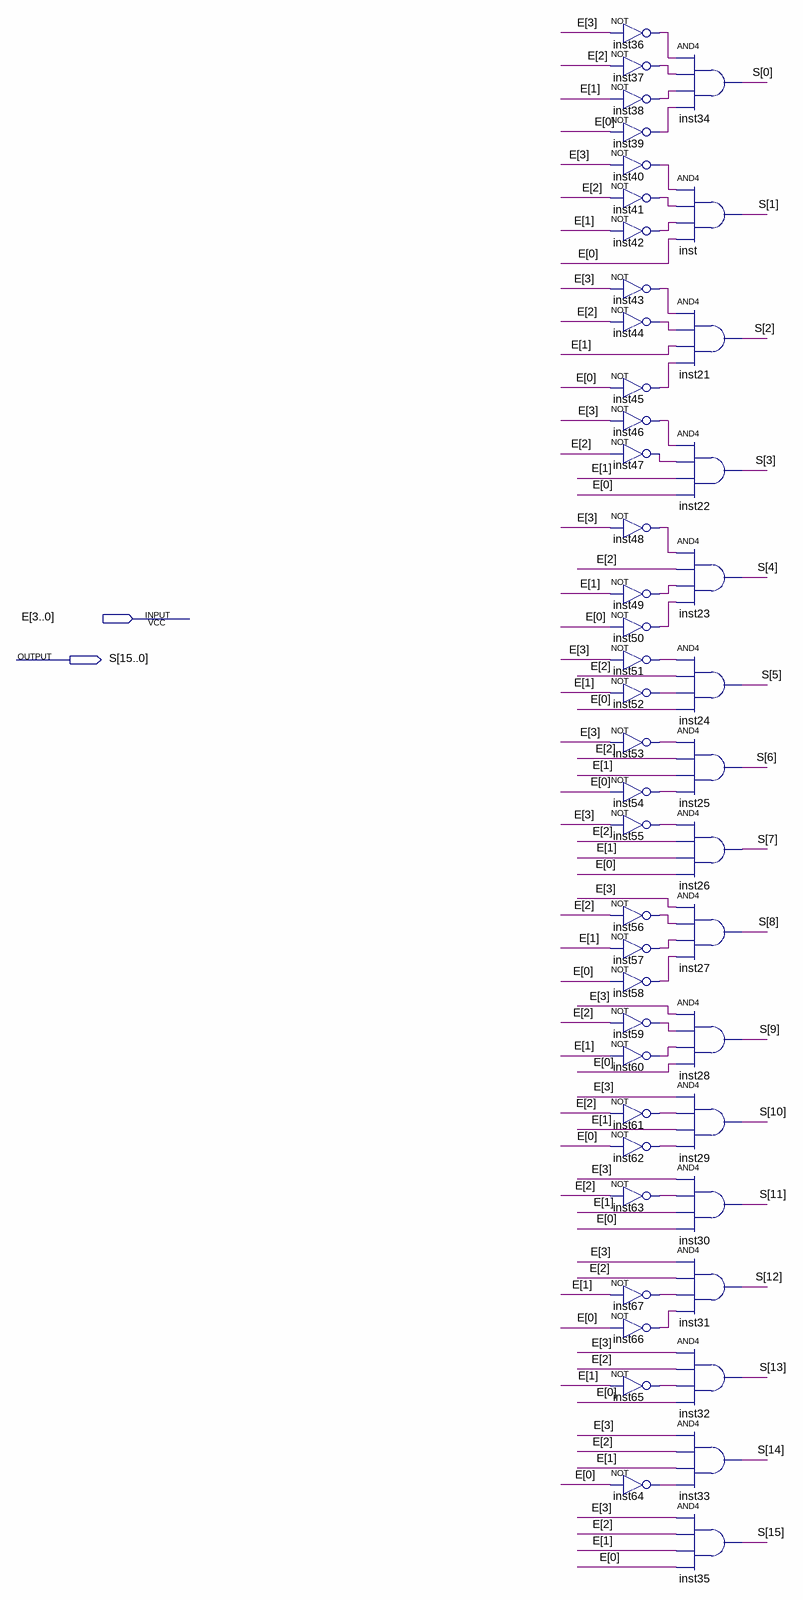
[diagram p0: schematic sheet]
// Quartus schematic Decodificador.bdf as structural Verilog: 48 symbols, 2 pins
module Decodificador (
  input  [3:0] E,
  output [15:0] S
);

  wire inst36_out, inst37_out, inst38_out, inst39_out, inst40_out, inst41_out, inst42_out, inst43_out,
       inst44_out, inst45_out, inst46_out, inst47_out, inst48_out, inst49_out, inst50_out, inst51_out,
       inst52_out, inst53_out, inst54_out, inst55_out, inst56_out, inst57_out, inst58_out, inst59_out,
       inst60_out, inst61_out, inst62_out, inst63_out, inst64_out, inst65_out, inst66_out, inst67_out;

  not inst36 (inst36_out, E[3]);
  not inst37 (inst37_out, E[2]);
  not inst38 (inst38_out, E[1]);
  not inst39 (inst39_out, E[0]);
  not inst40 (inst40_out, E[3]);
  not inst41 (inst41_out, E[2]);
  not inst42 (inst42_out, E[1]);
  not inst43 (inst43_out, E[3]);
  not inst44 (inst44_out, E[2]);
  not inst45 (inst45_out, E[0]);
  not inst46 (inst46_out, E[3]);
  not inst47 (inst47_out, E[2]);
  not inst48 (inst48_out, E[3]);
  not inst49 (inst49_out, E[1]);
  not inst50 (inst50_out, E[0]);
  not inst51 (inst51_out, E[3]);
  not inst52 (inst52_out, E[1]);
  not inst53 (inst53_out, E[3]);
  not inst54 (inst54_out, E[0]);
  not inst55 (inst55_out, E[3]);
  not inst56 (inst56_out, E[2]);
  not inst57 (inst57_out, E[1]);
  not inst58 (inst58_out, E[0]);
  not inst59 (inst59_out, E[2]);
  not inst60 (inst60_out, E[1]);
  not inst61 (inst61_out, E[2]);
  not inst62 (inst62_out, E[0]);
  not inst63 (inst63_out, E[2]);
  not inst67 (inst67_out, E[1]);
  not inst66 (inst66_out, E[0]);
  not inst65 (inst65_out, E[1]);
  not inst64 (inst64_out, E[0]);
  and inst34 (S[0], inst36_out, inst37_out, inst38_out, inst39_out);
  and inst (S[1], inst40_out, inst41_out, inst42_out, E[0]);
  and inst21 (S[2], inst43_out, inst44_out, E[1], inst45_out);
  and inst22 (S[3], inst46_out, inst47_out, E[1], E[0]);
  and inst23 (S[4], inst48_out, E[2], inst49_out, inst50_out);
  and inst24 (S[5], inst51_out, E[2], inst52_out, E[0]);
  and inst25 (S[6], inst53_out, E[2], E[1], inst54_out);
  and inst26 (S[7], inst55_out, E[2], E[1], E[0]);
  and inst27 (S[8], E[3], inst56_out, inst57_out, inst58_out);
  and inst28 (S[9], E[3], inst59_out, inst60_out, E[0]);
  and inst29 (S[10], E[3], inst61_out, E[1], inst62_out);
  and inst30 (S[11], E[3], inst63_out, E[1], E[0]);
  and inst31 (S[12], E[3], E[2], inst67_out, inst66_out);
  and inst32 (S[13], E[3], E[2], inst65_out, E[0]);
  and inst33 (S[14], E[3], E[2], E[1], inst64_out);
  and inst35 (S[15], E[3], E[2], E[1], E[0]);
endmodule
